# Altium project MCU103A.PrjPcb (part 2 of 4)

## Sheet MCU103A_F280039C_Device.SchDoc
size 431 x 279 mm; Date: Not shown in title block; ApprovedBy: Not shown in title block; CheckedBy: Not shown in title block; Author: Not shown in title block; CompanyName: Not shown in title block; Engineer: Not shown in title block; Organization: Not shown in title block; Address1: Not shown in title block; Address2: Not shown in title block; Address3: Not shown in title block; Address4: Not shown in title block; DocumentNumber: 4; Revision: Use project parameter SCH_Rev; SheetNumber: 4; SheetTotal: 8; PageSetup: Record=PageOptions|CenterHorizontal=True|CenterVertical=True|PrintScale=1.00|XCorrection=1.00|YCorrection=1.00|PrintKind=0|BorderSize=5000000|LeftOffset=0|BottomOffset=0|Orientation=2|PaperLength=1000|PaperWidth=1000|Scale=100|PaperSource=15|PrintQuality=600|MediaType=1|DitherType=10|PaperKind=Letter|PrintScaleMode=1; CurrentTime: Not shown in title block; CurrentDate: Not shown in title block; Time: Not shown in title block; DocumentFullPathAndName: Not shown in title block; DocumentName: Not shown in title block; ModifiedDate: Not shown in title block; ImagePath: Not shown in title block
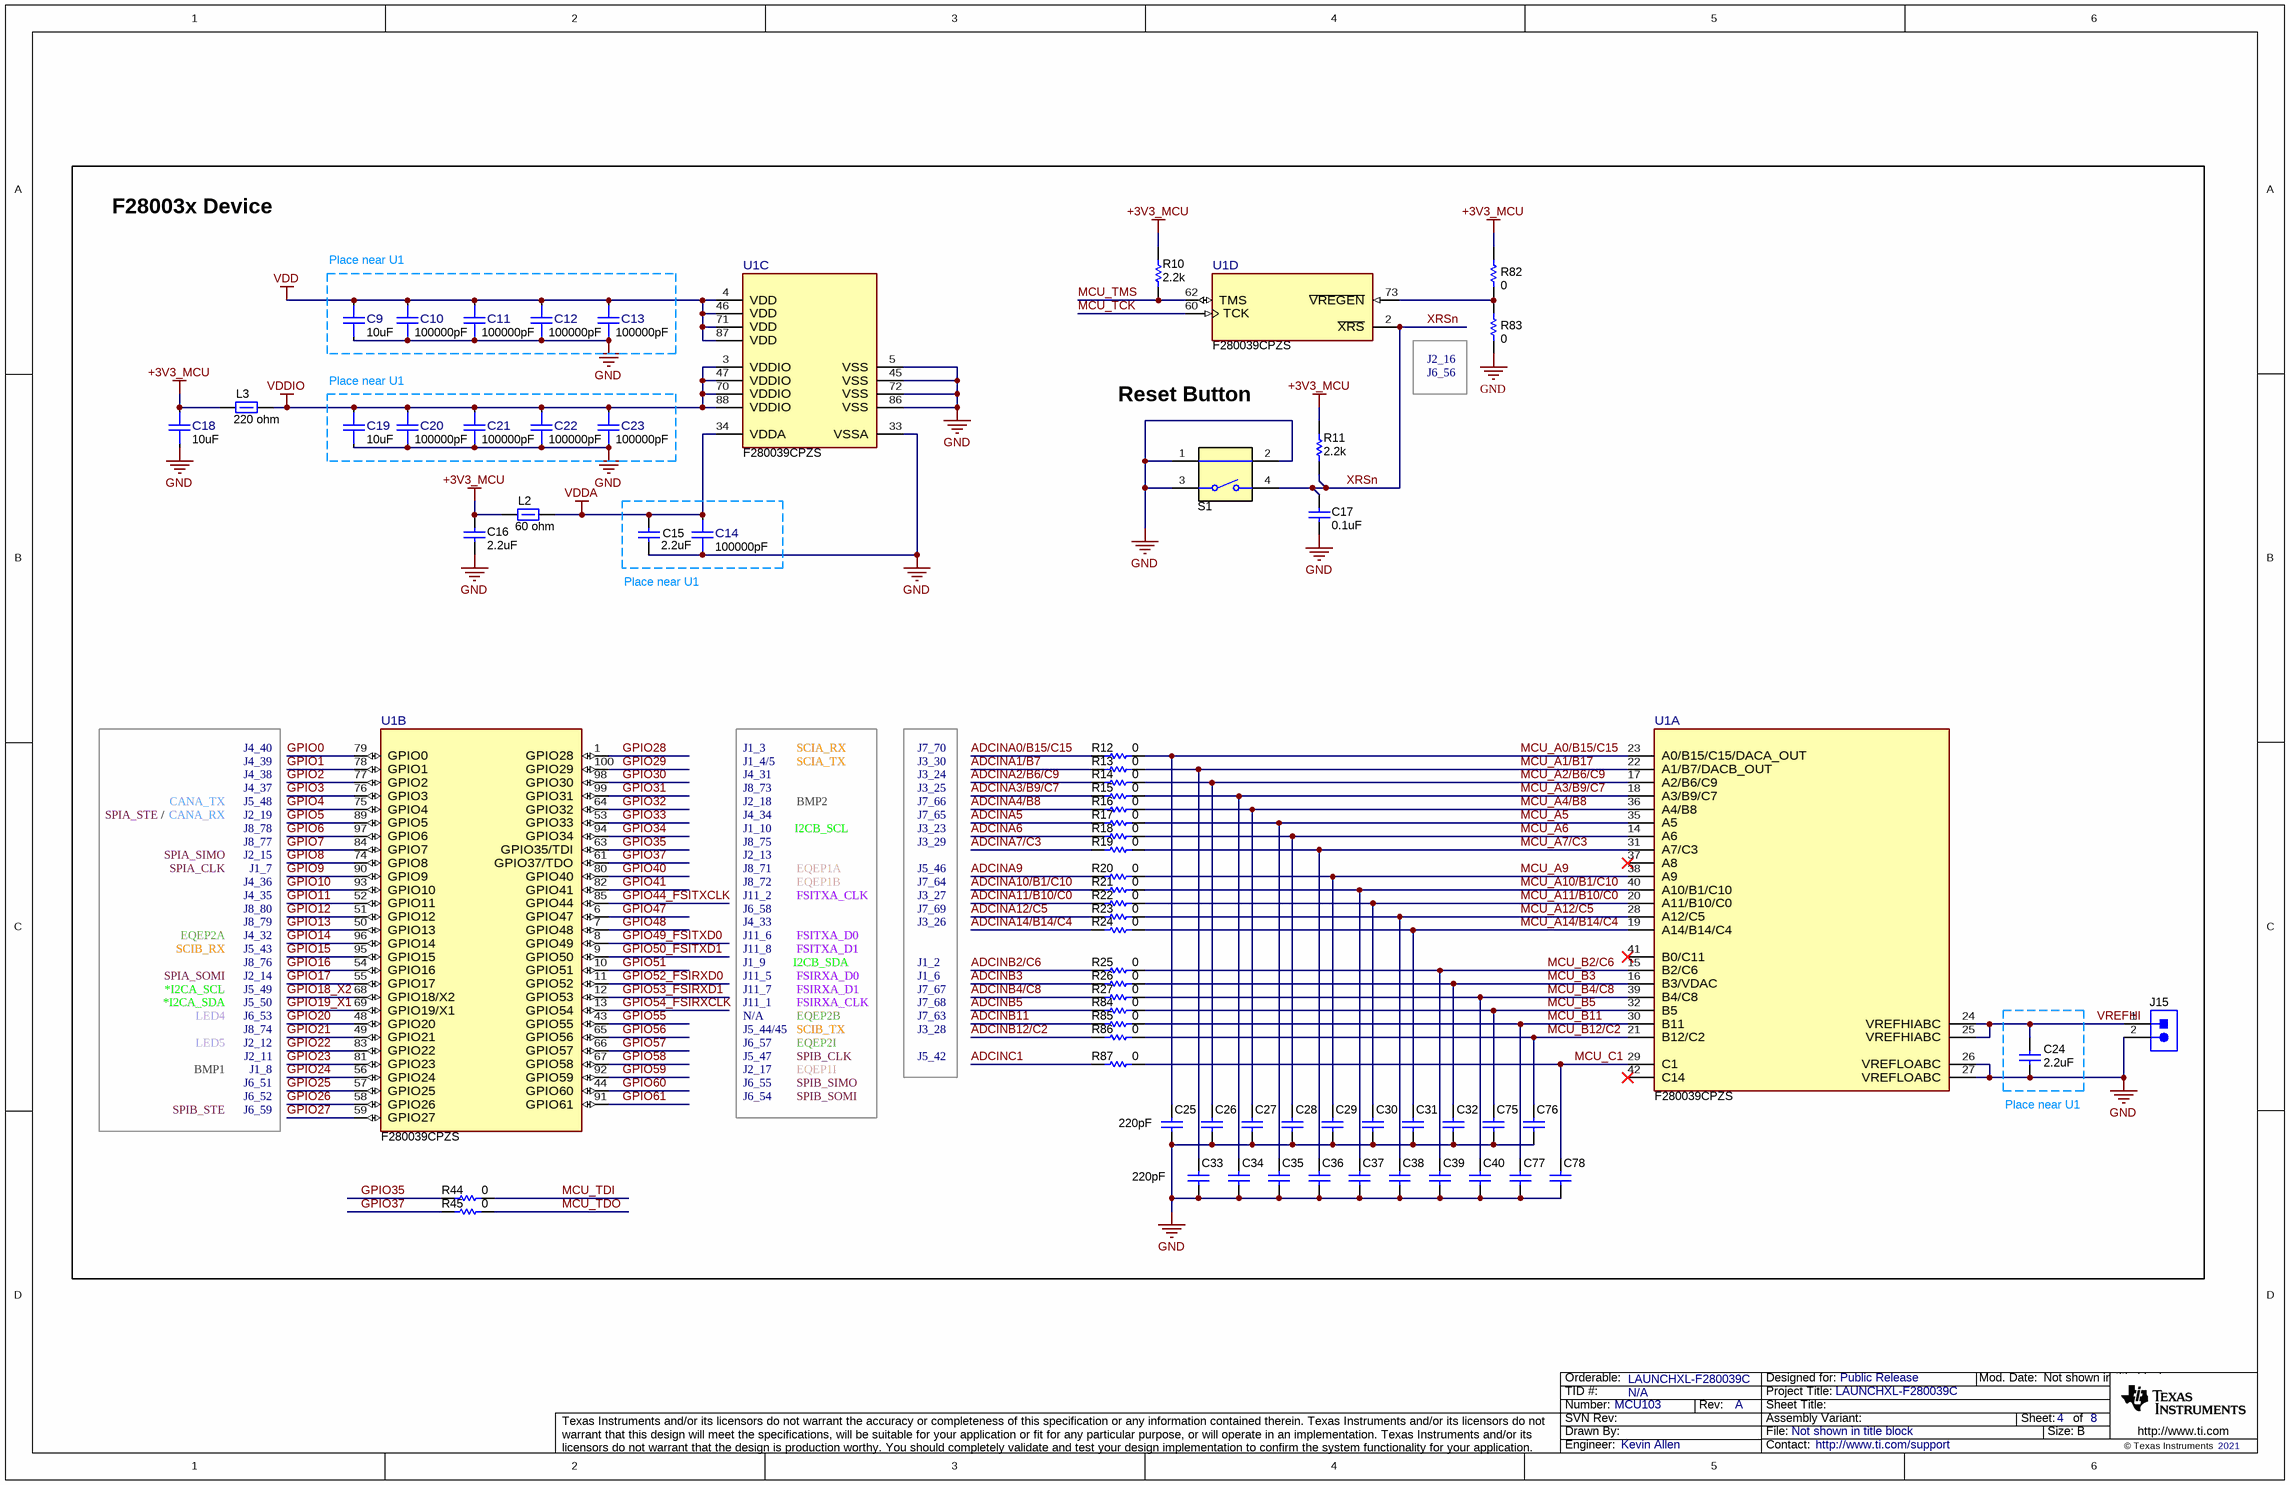
[diagram p3: MCU103A_F280039C_Device.SchDoc]

### Parts
C9  ValueDisplayed: 10uF  [FP-CC0603KRX5R6BB106_0603-MFG]  (hidden comment: CC0603KRX5R6BB106)
C10  ValueDisplayed: 100000pF  [FP-885012205018_0402-MFG]  (hidden comment: 885012205018)
C11  ValueDisplayed: 100000pF  [FP-885012205018_0402-MFG]  (hidden comment: 885012205018)
C12  ValueDisplayed: 100000pF  [FP-885012205018_0402-MFG]  (hidden comment: 885012205018)
C13  ValueDisplayed: 100000pF  [FP-885012205018_0402-MFG]  (hidden comment: 885012205018)
C14  ValueDisplayed: 100000pF  [FP-885012205018_0402-MFG]  (hidden comment: 885012205018)
C15  ValueDisplayed: 2.2uF  [0603]  (hidden comment: GRM188R61A225KE34D)
C16  ValueDisplayed: 2.2uF  [0603]  (hidden comment: GRM188R61A225KE34D)
C17  ValueDisplayed: 0.1uF  [0402]  (hidden comment: GRM155R71A104KA01D)
C18  ValueDisplayed: 10uF  [FP-CC0603KRX5R6BB106_0603-MFG]  (hidden comment: CC0603KRX5R6BB106)
C19  ValueDisplayed: 10uF  [FP-CC0603KRX5R6BB106_0603-MFG]  (hidden comment: CC0603KRX5R6BB106)
C20  ValueDisplayed: 100000pF  [FP-885012205018_0402-MFG]  (hidden comment: 885012205018)
C21  ValueDisplayed: 100000pF  [FP-885012205018_0402-MFG]  (hidden comment: 885012205018)
C22  ValueDisplayed: 100000pF  [FP-885012205018_0402-MFG]  (hidden comment: 885012205018)
C23  ValueDisplayed: 100000pF  [FP-885012205018_0402-MFG]  (hidden comment: 885012205018)
C24  ValueDisplayed: 2.2uF  [0603]  (hidden comment: GRM188R61A225KE34D)
C25  ValueDisplayed: 220pF  [0402]  (hidden comment: 885012005063)
C26  885012005063  [0402]  (value not drawn)
C27  885012005063  [0402]  (value not drawn)
C28  885012005063  [0402]  (value not drawn)
C29  885012005063  [0402]  (value not drawn)
C30  885012005063  [0402]  (value not drawn)
C31  885012005063  [0402]  (value not drawn)
C32  885012005063  [0402]  (value not drawn)
C33  ValueDisplayed: 220pF  [0402]  (hidden comment: 885012005063)
C34  885012005063  [0402]  (value not drawn)
C35  885012005063  [0402]  (value not drawn)
C36  885012005063  [0402]  (value not drawn)
C37  885012005063  [0402]  (value not drawn)
C38  885012005063  [0402]  (value not drawn)
C39  885012005063  [0402]  (value not drawn)
C40  885012005063  [0402]  (value not drawn)
C75  885012005063  [0402]  (value not drawn)
C76  885012005063  [0402]  (value not drawn)
C77  885012005063  [0402]  (value not drawn)
C78  885012005063  [0402]  (value not drawn)
J15  61300211121  [WURTH_61300211121]  (value not drawn)
L2  value 60 ohm  [0805_HV]  (hidden comment: 742792063)
L3  ValueDisplayed: 220 ohm  [0805_HV]  (hidden comment: 742792022)
R10  ValueDisplayed: 2.2k  [0402]  (hidden comment: CRCW04022K20JNED)
R11  ValueDisplayed: 2.2k  [0402]  (hidden comment: CRCW04022K20JNED)
R12  ValueDisplayed: 0  [0402]  (hidden comment: RC0402JR-070RL)
R13  ValueDisplayed: 0  [0402]  (hidden comment: RC0402JR-070RL)
R14  ValueDisplayed: 0  [0402]  (hidden comment: RC0402JR-070RL)
R15  ValueDisplayed: 0  [0402]  (hidden comment: RC0402JR-070RL)
R16  ValueDisplayed: 0  [0402]  (hidden comment: RC0402JR-070RL)
R17  ValueDisplayed: 0  [0402]  (hidden comment: RC0402JR-070RL)
R18  ValueDisplayed: 0  [0402]  (hidden comment: RC0402JR-070RL)
R19  ValueDisplayed: 0  [0402]  (hidden comment: RC0402JR-070RL)
R20  ValueDisplayed: 0  [0402]  (hidden comment: RC0402JR-070RL)
R21  ValueDisplayed: 0  [0402]  (hidden comment: RC0402JR-070RL)
R22  ValueDisplayed: 0  [0402]  (hidden comment: RC0402JR-070RL)
R23  ValueDisplayed: 0  [0402]  (hidden comment: RC0402JR-070RL)
R24  ValueDisplayed: 0  [0402]  (hidden comment: RC0402JR-070RL)
R25  ValueDisplayed: 0  [0402]  (hidden comment: RC0402JR-070RL)
R26  ValueDisplayed: 0  [0402]  (hidden comment: RC0402JR-070RL)
R27  ValueDisplayed: 0  [0402]  (hidden comment: RC0402JR-070RL)
R44  ValueDisplayed: 0  [0402]  (hidden comment: RC0402JR-070RL)
R45  ValueDisplayed: 0  [0402]  (hidden comment: RC0402JR-070RL)
R82  ValueDisplayed: 0  [0603]  (hidden comment: CRCW06030000Z0EA)
R83  ValueDisplayed: 0  [0603]  (hidden comment: CRCW06030000Z0EA)
R84  ValueDisplayed: 0  [0402]  (hidden comment: RC0402JR-070RL)
R85  ValueDisplayed: 0  [0402]  (hidden comment: RC0402JR-070RL)
R86  ValueDisplayed: 0  [0402]  (hidden comment: RC0402JR-070RL)
R87  ValueDisplayed: 0  [0402]  (hidden comment: RC0402JR-070RL)
S1  1188E-1K2-V-TR  [SW_1188E]  (value not drawn)
U1  F280039CPZS  [PZ0100A-MFG]  (parts A,B,C,D of 4)

### Nets
+3V3_MCU: C16.1 C18.2 L2.1 L3.1 R10.2 R11.2 R82.1
GND: C9.1 C10.1 C11.1 C12.1 C13.1 C14.1 C15.2 C16.2 C17.1 C18.1 C19.1 C20.1 C21.1 C22.1 C23.1 C24.2 C25.2 C26.2 C27.2 C28.2 C29.2 C30.2 C31.2 C32.2 C33.2 C34.2 C35.2 C36.2 C37.2 C38.2 C39.2 C40.2 C75.2 C76.2 C77.2 C78.2 J15.2 R83.2 S1.1 S1.2 S1.3 U1.5(VSS) U1.26(VREFLOABC) U1.27(VREFLOABC) U1.33(VSSA) U1.45(VSS) U1.72(VSS) U1.86(VSS)
VDD: C9.2 C10.2 C11.2 C12.2 C13.2 U1.4(VDD) U1.46(VDD) U1.71(VDD) U1.87(VDD)
VDDA: C14.2 C15.1 L2.2 U1.34(VDDA)
VDDIO: C19.2 C20.2 C21.2 C22.2 C23.2 L3.2 U1.3(VDDIO) U1.47(VDDIO) U1.70(VDDIO) U1.88(VDDIO)
ADCINA0/B15/C15: R12.1
ADCINA1/B7: R13.1
ADCINA2/B6/C9: R14.1
ADCINA3/B9/C7: R15.1
ADCINA4/B8: R16.1
ADCINA5: R17.1
ADCINA6: R18.1
ADCINA7/C3: R19.1
ADCINA9: R20.1
ADCINA10/B1/C10: R21.1
ADCINA11/B10/C0: R22.1
ADCINA12/C5: R23.1
ADCINA14/B14/C4: R24.1
ADCINB2/C6: R25.1
ADCINB3: R26.1
ADCINB4/C8: R27.1
ADCINB5: R84.1
ADCINB11: R85.1
ADCINB12/C2: R86.1
ADCINC1: R87.1
GPIO0: U1.79(GPIO0)
GPIO1: U1.78(GPIO1)
GPIO2: U1.77(GPIO2)
GPIO3: U1.76(GPIO3)
GPIO4: U1.75(GPIO4)
GPIO5: U1.89(GPIO5)
GPIO6: U1.97(GPIO6)
GPIO7: U1.84(GPIO7)
GPIO8: U1.74(GPIO8)
GPIO9: U1.90(GPIO9)
GPIO10: U1.93(GPIO10)
GPIO11: U1.52(GPIO11)
GPIO12: U1.51(GPIO12)
GPIO13: U1.50(GPIO13)
GPIO14: U1.96(GPIO14)
GPIO15: U1.95(GPIO15)
GPIO16: U1.54(GPIO16)
GPIO17: U1.55(GPIO17)
GPIO18_X2: U1.68(GPIO18/X2)
GPIO19_X1: U1.69(GPIO19/X1)
GPIO20: U1.48(GPIO20)
GPIO21: U1.49(GPIO21)
GPIO22: U1.83(GPIO22)
GPIO23: U1.81(GPIO23)
GPIO24: U1.56(GPIO24)
GPIO25: U1.57(GPIO25)
GPIO26: U1.58(GPIO26)
GPIO27: U1.59(GPIO27)
GPIO28: U1.1(GPIO28)
GPIO29: U1.100(GPIO29)
GPIO30: U1.98(GPIO30)
GPIO31: U1.99(GPIO31)
GPIO32: U1.64(GPIO32)
GPIO33: U1.53(GPIO33)
GPIO34: U1.94(GPIO34)
GPIO35: R44.1 U1.63(GPIO35/TDI)
GPIO37: R45.1 U1.61(GPIO37/TDO)
GPIO40: U1.80(GPIO40)
GPIO41: U1.82(GPIO41)
GPIO44_FSITXCLK: U1.85(GPIO44)
GPIO47: U1.6(GPIO47)
GPIO48: U1.7(GPIO48)
GPIO49_FSITXD0: U1.8(GPIO49)
GPIO50_FSITXD1: U1.9(GPIO50)
GPIO51: U1.10(GPIO51)
GPIO52_FSIRXD0: U1.11(GPIO52)
GPIO53_FSIRXD1: U1.12(GPIO53)
GPIO54_FSIRXCLK: U1.13(GPIO54)
GPIO55: U1.43(GPIO55)
GPIO56: U1.65(GPIO56)
GPIO57: U1.66(GPIO57)
GPIO58: U1.67(GPIO58)
GPIO59: U1.92(GPIO59)
GPIO60: U1.44(GPIO60)
GPIO61: U1.91(GPIO61)
MCU_A0/B15/C15: C25.1 R12.2 U1.23(A0/B15/C15/DACA_OUT)
MCU_A1/B17: C33.1 R13.2 U1.22(A1/B7/DACB_OUT)
MCU_A2/B6/C9: C26.1 R14.2 U1.17(A2/B6/C9)
MCU_A3/B9/C7: C34.1 R15.2 U1.18(A3/B9/C7)
MCU_A4/B8: C27.1 R16.2 U1.36(A4/B8)
MCU_A5: C35.1 R17.2 U1.35(A5)
MCU_A6: C28.1 R18.2 U1.14(A6)
MCU_A7/C3: C36.1 R19.2 U1.31(A7/C3)
MCU_A9: C29.1 R20.2 U1.38(A9)
MCU_A10/B1/C10: C37.1 R21.2 U1.40(A10/B1/C10)
MCU_A11/B10/C0: C30.1 R22.2 U1.20(A11/B10/C0)
MCU_A12/C5: C38.1 R23.2 U1.28(A12/C5)
MCU_A14/B14/C4: C31.1 R24.2 U1.19(A14/B14/C4)
MCU_B2/C6: C39.1 R25.2 U1.15(B2/C6)
MCU_B3: C32.1 R26.2 U1.16(B3/VDAC)
MCU_B4/C8: C40.1 R27.2 U1.39(B4/C8)
MCU_B5: C75.1 R84.2 U1.32(B5)
MCU_B11: C77.1 R85.2 U1.30(B11)
MCU_B12/C2: C76.1 R86.2 U1.21(B12/C2)
MCU_C1: C78.1 R87.2 U1.29(C1)
MCU_TCK: U1.60(TCK)
MCU_TDI: R44.2
MCU_TDO: R45.2
MCU_TMS: R10.1 U1.62(TMS)
VREFHI: C24.1 J15.1 U1.24(VREFHIABC) U1.25(VREFHIABC)
XRSn: C17.2 R11.1 S1.4 U1.2(~{XRS})
NetR82_2: R82.2 R83.1 U1.73(~{VREGEN})

Not connected (* = marked no-connect by the designer): U1 37(A8)* 41(B0/C11)* 42(C14)*

### Notes on the sheet
- F28003x Device
- Place near U1
- J2_16
- Reset Button
- J6_56
- J4_40
- J4_39
- J1_3
- J1_4/5
- SCIA_RX
- SCIA_TX
- J3_30
- J7_70
- SPIA_STE
- /
- CANA_TX
- CANA_RX
- J4_38
- J4_37
- J2_19
- J5_48
- J8_78
- J4_31
- J4_34
- J2_18
- J1_10
- J8_73
- BMP2
- I2CB_SCL
- J3_25
- J3_24
- J3_23
- J7_66
- J7_65
- SPIA_SIMO
- SPIA_CLK
- J4_36
- J4_35
- J2_15
- J1_7
- J8_77
- J2_13
- J8_75
- J8_72
- J8_71
- J11_2
- EQEP1A
- EQEP1B
- FSITXA_CLK
- J3_29
- J3_27
- J5_46
- J7_64
- EQEP2A
- SCIB_RX
- J4_32
- J5_43
- J8_80
- J8_79
- J8_76
- J4_33
- J1_9
- J6_58
- J11_6
- J11_8
- FSITXA_D0
- FSITXA_D1
- I2CB_SDA
- J1_2
- J3_26
- J7_69
- *I2CA_SCL
- *I2CA_SDA
- LED4
- SPIA_SOMI
- J2_14
- J5_49
- J5_50
- J8_74
- J6_53
- J5_44/45
- J11_5
- J11_7
- J11_1
- N/A
- FSIRXA_D0
- FSIRXA_D1
- FSIRXA_CLK
- EQEP2B
- SCIB_TX
- J1_6
- J3_28
- J7_68
- J7_67
- J7_63
- LED5
- BMP1
- J2_12
- J2_11
- J1_8
- J6_52
- J6_51
- J2_17
- J5_47
- J6_57
- J6_55
- J6_54
- EQEP2I
- EQEP1I
- SPIB_CLK
- SPIB_SIMO
- SPIB_SOMI
- J5_42
- (near C24) Place near U1
- SPIB_STE
- J6_59
- Drawn By:
- SVN Rev:
- Number:
- TID #:
- Orderable:
- Rev:
- Sheet Title:
- File:
- Project Title:
- Designed for:
- Assembly Variant:
- Mod. Date:
- Sheet:
- Size:
- of
- B
- http://www.ti.com
- Texas Instruments and/or its licensors do not warrant the accuracy or completeness of this specification or any information contained therein. Texas Instruments and/or its licensors do not warrant that this design will meet the specifications, will be suitable for your application or fit for any particular purpose, or will operate in an implementation. Texas Instruments and/or its licensors do not warrant that the design is production worthy. You should completely validate and test your design implementation to confirm the system functionality for your application.
- Engineer:
- Contact:
- © Texas Instruments

### Library data of the parts
C9 C18 C19 = CMP-0092309-1: Cap Ceramic 10uF 10V X5R 10% SMD 0603 85C Paper T/R; Manufacturer: YAGEO; Cap_F: 10µF; TempCo: 15%; Category 7542B8484461Ae85: Passive Components; Category 4C11811B7D3097D6: Single Components; SizeZ_mm: 1mm; Category F8883582C9A8234F: Capacitors; AEC Qualified: No; Value: 10µF; Category 85Ce48C4B2B95E09: Uncategorized; Supplier Part Number 2: 603-CC603KRX5R6BB106; Operating Temperature Range: -55°C to +85°C; PackageReference: 0603; Supplier Part Number 1: 311-1782-1-ND; Digikey Part Number: 311-1782-1-ND; Digikey Description: CAP CER 10UF 10V X5R 0603; Tolerance_%: 10%; datasheet: https://www.yageo.com/upload/media/product/productsearch/datasheet/mlcc/UPY-GPHC_X5R_4V-to-50V_26.pdf; ComponentLink1URL: https://www.yageo.com/upload/media/product/productsearch/datasheet/mlcc/UPY-GPHC_X5R_4V-to-50V_26.pdf; Supplier 2: Mouser; Octopart Part Number: 1f0ad7d7c223c0cd; VDC_V: 10V; Datasheet Path: datasheets/Cap-CC0603KRX5R6BB106.pdf; PartNumber: CC0603KRX5R6BB106; RoHS: TRUE; Part Number: CC0603KRX5R6BB106; helpURL: https://upverter.com/upn/revision/d12d152cf6e6e3e0/; ComponentLink1Description: Datasheet; Temperature Characteristic: X5R; Supplier 1: Digikey; Mouser Description: Multilayer Ceramic Capacitors MLCC - SMD/SMT 10M pF 10% 10 Volts; Mouser Part Number: 603-CC603KRX5R6BB106; Lead Free: Yes
C10-C14 C20-C23 = CMP-0090362-1: 0.1µF ±10% 10V Ceramic Capacitor X7R 0402 (1005 Metric); Manufacturer: Wurth Electronics; AEC Qualified: No; Value: 100nF; SizeZ_mm: 0.55mm; TempCo: 15%; RoHS: TRUE; Tolerance_%: 10%; datasheet: https://www.we-online.com/catalog/datasheet/885012205018.pdf; Lead Free: Yes; Operating Temperature Range: -55°C to +125°C; ComponentLink1Description: Datasheet; Digikey Description: CAP CER 0.1UF 10V X7R 0402; Supplier Part Number 1: 732-7513-1-ND; Supplier 2: Mouser; Mouser Part Number: 710-885012205018; Digikey Part Number: 732-7513-1-ND; Temperature Characteristic: X7R; Supplier 1: Digikey; Datasheet Path: datasheets/Cap-885012205018.pdf; ComponentLink1URL: https://www.we-online.com/catalog/datasheet/885012205018.pdf; VDC_V: 10V; Supplier Part Number 2: 710-885012205018; Cap_F: 100nF; PackageReference: 0402; PartNumber: 885012205018; Part Number: 885012205018; helpURL: https://upverter.com/upn/revision/1acbe355db19639d/
C15 C16 C24 = CMP-0007323-5: CAP, CERM, 2.2 uF, 10 V, +/- 10%, X5R, 0603; Manufacturer: MuRata; Polarized: N; Value: 2.2uF; U/M: EA; Cap_F: 2.2µF; Value1: Unknown; VDC_V: 10V; TaMin_C: -55°C; TaMax_C: 85°C; SizeArea_mm2: 1.28; SizeAreaWB_mm2: 4.68; SizeX_mm: 1.6; SizeY_mm: 0.8; SizeZ_mm: 1; AEC Category: Q200; CompType: Capacitor; PartNumber: GRM188R61A225KE34D; PackageReference: 0603; RoHS: Y; Tolerance_%: 10%; Value2: 10V; MountType: SMT; Technology: Ceramic; TempCo: X5R; Cap_Case: 0603; Published: 2008-06-19; Publisher: Texas Instruments; LatestRevisionDate: 2017-03-09; ComponentLink1Description: Datasheet link; ComponentLink1URL: http://search.murata.co.jp/Ceramy/PnsearchViewAction.do?HnOFG=ON&HnNFG=ON&SEL_CNT=50&sLang=en&sKey=GRM188R61A225KE34D&x=9&y=9&search=startwith; Supplier 1: Digi-Key; Supplier Part Number 1: 490-1545-1-ND; Supplier 2: Mouser; Supplier Part Number 2: 81-GRM188R61A225KE34; Supplier 3: Farnell; Supplier Part Number 3: 1828799; AEC Qualified: ?
C17 = CMP-0006629-2: CAP, CERM, 0.1 uF, 10 V, +/- 10%, X7R, 0402; Manufacturer: MuRata; Polarized: N; Value: 0.1uF; U/M: EA; Cap_F: 100nF; Value1: Unknown; VDC_V: 10V; TaMin_C: -55°C; TaMax_C: 125°C; SizeArea_mm2: 0.5; SizeAreaWB_mm2: 3; SizeX_mm: 1; SizeZ_mm: 0.6; AEC Category: Q200; CompType: Capacitor; PartNumber: GRM155R71A104KA01D; PackageReference: 0402; RoHS: Y; Tolerance_%: 10%; Value2: 10V; MountType: SMT; Technology: Ceramic; TempCo: X7R; Cap_Case: 0402; SizeY_mm: 0.5; Published: 2008-06-19; Publisher: Texas Instruments; LatestRevisionDate: 2017-03-09; ComponentLink1Description: Datasheet link; ComponentLink1URL: http://search.murata.co.jp/Ceramy/PnsearchViewAction.do?HnOFG=ON&HnNFG=ON&SEL_CNT=50&sLang=en&sKey=GRM155R71A104KA01D&x=9&y=9&search=startwith; Supplier 1: Digi-Key; Supplier Part Number 1: GRM155R71A104KA01D-ND; Supplier 2: Newark; Supplier Part Number 2: 14T3278; Supplier 3: Mouser; Supplier Part Number 3: 81-GRM155R71A104KA1D; AEC Qualified: ?
C25-C40 C75-C78 = CMP-0006218-2: CAP, CERM, 220 pF, 50 V, +/- 5%, C0G/NP0, 0402; Manufacturer: Wurth Elektronik; TaMin_C: -55°C; Polarized: N; SizeAreaWB_mm2: 3; Value1: Unknown; U/M: EA; Value: 220pF; TaMax_C: 125°C; SizeZ_mm: 0.6; SizeX_mm: 1; SizeY_mm: 0.5; Value2: 50V; AEC Category: Q200; Supplier Part Number 2: 710-885012005063; Publisher: Texas Instruments; Supplier 2: Mouser; TempCo: C0G/NP0; Published: 2008-06-19; RoHS: Y; MountType: SMT; Supplier 1: Digi-Key; PackageReference: 0402; Tolerance_%: 5%; Cap_Case: 0402; SizeArea_mm2: 0.5; CompType: Capacitor; LatestRevisionDate: 2017-03-09; PartNumber: 885012005063; AEC Qualified: N; Cap_F: 220pF; VDC_V: 50V; ComponentLink1Description: Datasheet link; AEC Grade: N/A; Supplier Part Number 1: 732-7477-1-ND; Technology: Ceramic; ComponentLink1URL: http://katalog.we-online.de/pbs/datasheet/885012005063.pdf
  C26-C32 C34-C40 C75-C78: ValueDisplayed: 220pF
J15 = CMP-0054794-1: Header, 2.54 mm, 2x1, Gold, TH; Manufacturer: Wurth Elektronik; Green_Lifecycle: Active; Green_REACh: Passed; CNHeader: TRUE; CT: FALSE; PartNumber: 61300211121; PackageReference: Header, 2.54mm, 2x1, TH; ClassName: Header; CompType: Header; RoHS: Y; MountType: TH; ComponentLink1Description: Datasheet URL; ComponentLink1URL: http://katalog.we-online.de/em/datasheet/6130xx11121.pdf; Publisher: Texas Instruments; LatestRevisionDate: 26/05/2017; Supplier 1: Digi-Key; Supplier Part Number 1: 732-5315-ND; Supplier 2: Newark; Supplier Part Number 2: 20X0948; Supplier 3: Mouser; Supplier Part Number 3: 710-61300211121; Green_EU RoHS: Passed; Green_EU RoHS-2: Incomplete
L2 = CMP-0003093-1: Ferrite Bead, 60 ohm @ 100 MHz, 3 A, 0805; Manufacturer: Wurth Elektronik; Ztyp@1GHz_Ohm: 95.384; ZTyp@100MHz_Ohm: 60; SizeAreaWB_mm2: 6.75; DCR_ohm: 0.025; Value1: 0.025 ohm; Imax_A: 3A; SizeZ_mm: 1.45; SizeX_mm: 2; SizeY_mm: 1.25; SizeArea_mm2: 2.5; ComponentLink1URL: http://katalog.we-online.de/pbs/datasheet/742792063.pdf; Supplier Part Number 2: 710-742792063; Publisher: Texas Instruments; Supplier 2: Mouser; Published: 2014-04-30; RoHS: Y; MountType: SMT; Supplier 1: Digi-Key; PackageReference: 0805; Value2: 3A; CompType: Ferrite Bead; LatestRevisionDate: 2017-03-09; PartNumber: 742792063; ComponentLink1Description: Datasheet link; Supplier Part Number 1: 732-1612-1-ND; ValueDisplayed: 60 ohm
L3 = CMP-0003073-1: Ferrite Bead, 220 ohm @ 100 MHz, 2 A, 0805; Manufacturer: Wurth Elektronik; Ztyp@1GHz_Ohm: 190.289; ZTyp@100MHz_Ohm: 220; SizeAreaWB_mm2: 6.75; DCR_ohm: 0.05; Value1: 0.05 ohm; Value: 220 ohm; Imax_A: 2A; SizeZ_mm: 1.45; SizeX_mm: 2; SizeY_mm: 1.25; SizeArea_mm2: 2.5; ComponentLink1URL: http://katalog.we-online.de/pbs/datasheet/742792022.pdf; Supplier Part Number 2: 710-742792022; Publisher: Texas Instruments; Supplier 2: Mouser; Published: 2014-04-30; RoHS: Y; MountType: SMT; Supplier 1: Digi-Key; PackageReference: 0805; Value2: 2A; CompType: Ferrite Bead; LatestRevisionDate: 2017-03-09; PartNumber: 742792022; ComponentLink1Description: Datasheet link; Supplier Part Number 1: 732-1614-1-ND
R10 R11 = CMP-0026890-5: RES, 2.2 k, 5%, 0.063 W, AEC-Q200 Grade 0, 0402; Manufacturer: Vishay-Dale; Value: 2.2k; Value_Code: 2k20; Power_W: 63mW; Value2: 0.063W; VDC_V: 50V; TempCo: 200 ppm/C; SizeArea_mm2: 0.5; SizeX_mm: 1; SizeZ_mm: 0.6; EIA_Code: E24; AEC Category: Q200; AEC Qualified: Y; AEC Grade: 0; CompType: Resistor; PartNumber: CRCW04022K20JNED; PackageReference: 0402; RoHS: E; Res_ohm: 2.2k; Tolerance_%: 5%; Value1: 5%; MountType: SMT; Technology: Thick Film; SizeY_mm: 0.5; ComponentLink1Description: Datasheet link; ComponentLink1URL: http://www.vishay.com/docs/20035/dcrcwe3.pdf; Supplier 1: Digi-Key; Supplier Part Number 1: 541-2.2KJCT-ND; Supplier 2: Newark; Supplier Part Number 2: 59M6710; Supplier 3: Mouser; Supplier Part Number 3: 71-CRCW0402J-2.2K-E3
R12-R27 R44 R45 R84-R87 = CMP-0027004-2: RES, 0, 5%, 0.063 W, 0402; Manufacturer: Yageo America; Power_W: 63mW; TempCo: 200 ppm/C; Value_Code: 0000; U/M: EA; Value: 0; EIA_Code: E24; SizeX_mm: 1; SizeY_mm: 0.5; SizeZ_mm: 0.6; Value2: 0.063W; VDC_V: 50V; AEC Category: Q200; Supplier Part Number 2: 603-RC0402JR-070RL; Publisher: Texas Instruments; Supplier 2: Mouser; Supplier Part Number 3: 9232516; Supplier 3: Farnell; Published: 2008-06-26; RoHS: Y; Value1: 5%; MountType: SMT; Supplier 1: Digi-Key; PackageReference: 0402; Tolerance_%: 5%; Res_ohm: 0; SizeArea_mm2: 0.5; CompType: Resistor; LatestRevisionDate: 2017-03-09; PartNumber: RC0402JR-070RL; AEC Qualified: ?; ComponentLink1Description: Datasheet link; Supplier Part Number 1: 311-0.0JRCT-ND; Technology: Thick Film; ComponentLink1URL: http://www.yageo.com/pdf/Pu-RC0402_51_PbFree_L_2.pdf
R82 R83 = CMP-0025697-4: RES, 0, 5%, 0.1 W, AEC-Q200 Grade 0, 0603; Manufacturer: Vishay-Dale; Value: 0; Value_Code: 0000; Power_W: 100mW; Value2: 0.1W; VDC_V: 75V; TempCo: 200 ppm/C; SizeArea_mm2: 1.28; SizeX_mm: 1.6; SizeY_mm: 0.8; SizeZ_mm: 1; EIA_Code: E24; AEC Category: Q200; AEC Qualified: Y; CompType: Resistor; PartNumber: CRCW06030000Z0EA; PackageReference: 0603; RoHS: E; Res_ohm: 0; Tolerance_%: 5%; Value1: 5%; MountType: SMT; Technology: Thick Film; ComponentLink1Description: Datasheet link; ComponentLink1URL: http://www.vishay.com/docs/20035/dcrcwe3.pdf; Supplier 1: Digi-Key; Supplier Part Number 1: 541-0.0GCT-ND; Supplier 2: Newark; Supplier Part Number 2: 52K8014; Supplier 3: Mouser; Supplier Part Number 3: 71-CRCW0603-0-E3; AEC Grade: 0
S1 = CMP-0002328-1: Switch, SPST, 0.05 A, 12 VDC, SMD; Manufacturer: Diptronics; SizeAreaWB_mm2: 53.9; SizeArea_mm2: 27.3; SizeX_mm: 7.8; SizeY_mm: 3.5; VDC_V: 12V; PositionCount: 1; CurrentRating_mA: 50A; PartNumber: 1188E-1K2-V-TR; MountType: SMT; SizeZ_mm: 3.5; ComponentLink1Description: Datasheet URL; ComponentLink1URL: http://www.dip.com.tw/en/en-product-information/en-switch004/item/download/1976_b080c057386714e3a6604cbe658b9df3; RoHS: Y; Circuit: SPST; Orientation: Side Actuated; CompType: Switch; PackageReference: 7.8x3.5mm; Publisher: Texas Instruments; LatestRevisionDate: 2017-03-09
U1 = CMP-0091701-2: Real-Time Microcontroller 32bit, 120MHz, 384KBytes Flash, 69KBytes RAM, PQFP100; Manufacturer: Texas Instruments; Number Of Cores: 1; Core Architecture: TMS320C28x; SizeZ_mm: 1.6mm; Number Of A/D Converters: 3; AEC Qualified: No; Standoff Height: 0.05mm; TJmax_C: +125°C; Number Of Pwm Channels: 16; CompType: IC; Number Of I/Os: 55; Number Of Adc Channels: 23; Interface: I2C,SPI,UART,CAN,LIN,SCI,Other; Data Bus Width: 32bits; Number Of Spi Channels: 2; Number Of Uart Channels: 4; AEC Category: Q200; Memory Size: 384KBytes; ComponentLink3Description: Online Datasheet; Memory Type: FLASH; PackageReference: PQFP100; Operating Temperature Range: -40°C to +125°C; Frequency_Fixed: 120MHz; Part Number: F280039CPZS; ComponentLink1URL: http://www.ti.com/lit/ds/symlink/GPN.pdf; ComponentLink3URL: http://www.ti.com/product/GPN/datasheet; ComponentLink2Description: Product Folder; PartNumber: F280039CPZS; Ram Size: 69KBytes; ComponentLink1Description: Datasheet Link; RoHS: UNKNOWN; Number Of Timers/Counters: 3; helpURL: https://upverter.com/upn/revision/79ab1500d65182d7/; ComponentLink2URL: http://www.ti.com/product/GPN; Number Of I2C Channels: 2; Datasheet Path: datasheets/IC-F280039CPZS.pdf

## Sheet MCU103A_F2800137_Device.SchDoc
size 431 x 279 mm; Date: Not shown in title block; ApprovedBy: Not shown in title block; CheckedBy: Not shown in title block; Author: Not shown in title block; CompanyName: Not shown in title block; Engineer: Not shown in title block; Organization: Not shown in title block; Address1: Not shown in title block; Address2: Not shown in title block; Address3: Not shown in title block; Address4: Not shown in title block; DocumentNumber: 4; Revision: Use project parameter SCH_Rev; SheetNumber: 5; SheetTotal: 8; PageSetup: Record=PageOptions|CenterHorizontal=True|CenterVertical=True|PrintScale=1.00|XCorrection=1.00|YCorrection=1.00|PrintKind=0|BorderSize=5000000|LeftOffset=0|BottomOffset=0|Orientation=2|PaperLength=1000|PaperWidth=1000|Scale=100|PaperSource=15|PrintQuality=600|MediaType=1|DitherType=10|PaperKind=Letter|PrintScaleMode=1; CurrentTime: Not shown in title block; CurrentDate: Not shown in title block; Time: Not shown in title block; DocumentFullPathAndName: Not shown in title block; DocumentName: Not shown in title block; ModifiedDate: Not shown in title block; ImagePath: Not shown in title block
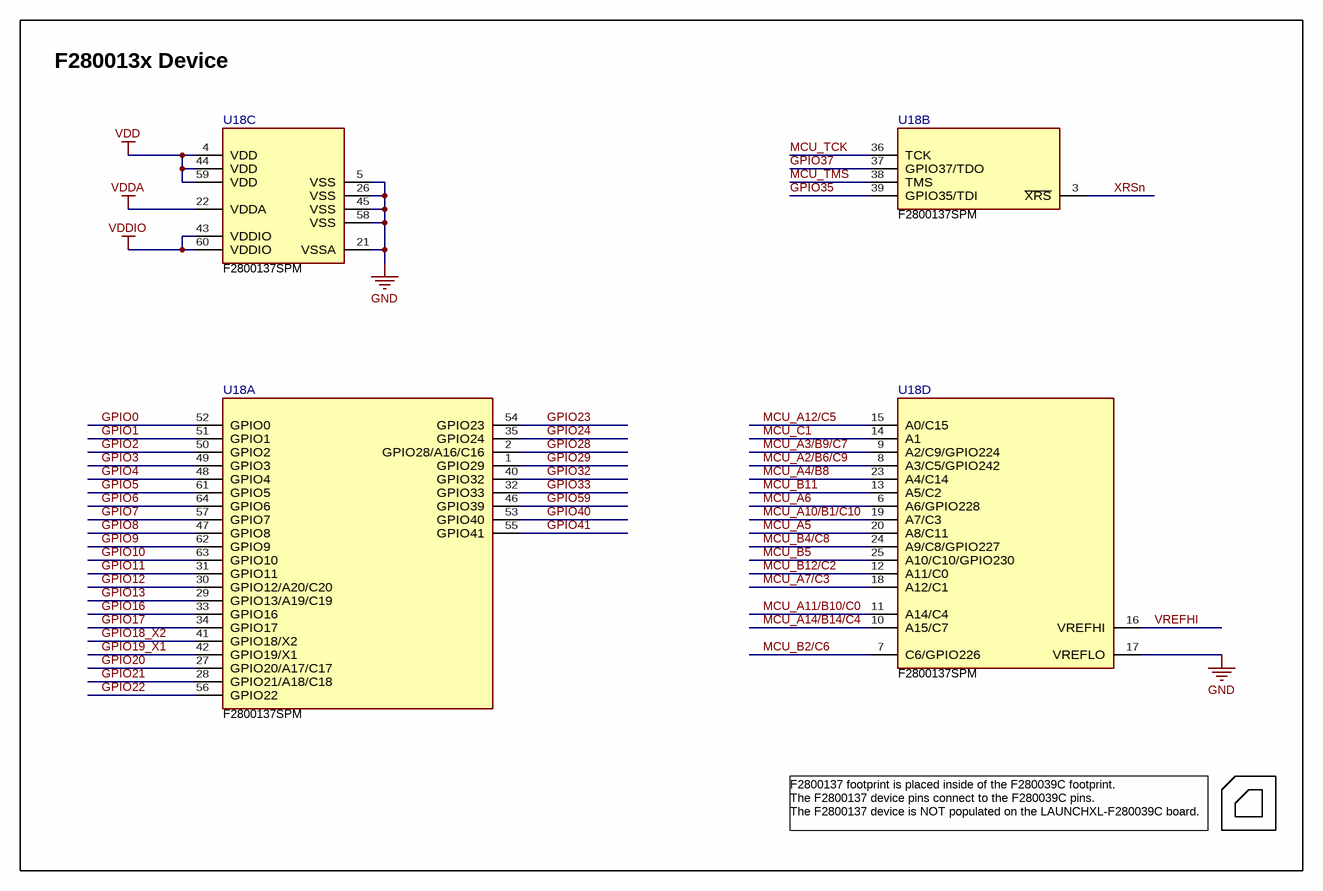
[diagram p4: MCU103A_F2800137_Device.SchDoc]

### Parts
U18  F2800137SPM  [PM0064A-IPC_C]  (parts A,B,C,D of 4)

### Blocks framed on the sheet
F280013x Device: U18

### Nets
GND: U18.5(VSS) U18.17(VREFLO) U18.21(VSSA) U18.26(VSS) U18.45(VSS) U18.58(VSS)
VDD: U18.4(VDD) U18.44(VDD) U18.59(VDD)
VDDA: U18.22(VDDA)
VDDIO: U18.43(VDDIO) U18.60(VDDIO)
GPIO0: U18.52(GPIO0)
GPIO1: U18.51(GPIO1)
GPIO2: U18.50(GPIO2)
GPIO3: U18.49(GPIO3)
GPIO4: U18.48(GPIO4)
GPIO5: U18.61(GPIO5)
GPIO6: U18.64(GPIO6)
GPIO7: U18.57(GPIO7)
GPIO8: U18.47(GPIO8)
GPIO9: U18.62(GPIO9)
GPIO10: U18.63(GPIO10)
GPIO11: U18.31(GPIO11)
GPIO12: U18.30(GPIO12/A20/C20)
GPIO13: U18.29(GPIO13/A19/C19)
GPIO16: U18.33(GPIO16)
GPIO17: U18.34(GPIO17)
GPIO18_X2: U18.41(GPIO18/X2)
GPIO19_X1: U18.42(GPIO19/X1)
GPIO20: U18.27(GPIO20/A17/C17)
GPIO21: U18.28(GPIO21/A18/C18)
GPIO22: U18.56(GPIO22)
GPIO23: U18.54(GPIO23)
GPIO24: U18.35(GPIO24)
GPIO28: U18.2(GPIO28/A16/C16)
GPIO29: U18.1(GPIO29)
GPIO32: U18.40(GPIO32)
GPIO33: U18.32(GPIO33)
GPIO35: U18.39(GPIO35/TDI)
GPIO37: U18.37(GPIO37/TDO)
GPIO40: U18.53(GPIO40)
GPIO41: U18.55(GPIO41)
GPIO59: U18.46(GPIO39)
MCU_A2/B6/C9: U18.8(A3/C5/GPIO242)
MCU_A3/B9/C7: U18.9(A2/C9/GPIO224)
MCU_A4/B8: U18.23(A4/C14)
MCU_A5: U18.20(A8/C11)
MCU_A6: U18.6(A6/GPIO228)
MCU_A7/C3: U18.18(A12/C1)
MCU_A10/B1/C10: U18.19(A7/C3)
MCU_A11/B10/C0: U18.11(A14/C4)
MCU_A12/C5: U18.15(A0/C15)
MCU_A14/B14/C4: U18.10(A15/C7)
MCU_B2/C6: U18.7(C6/GPIO226)
MCU_B4/C8: U18.24(A9/C8/GPIO227)
MCU_B5: U18.25(A10/C10/GPIO230)
MCU_B11: U18.13(A5/C2)
MCU_B12/C2: U18.12(A11/C0)
MCU_C1: U18.14(A1)
MCU_TCK: U18.36(TCK)
MCU_TMS: U18.38(TMS)
VREFHI: U18.16(VREFHI)
XRSn: U18.3(~{XRS})

### Notes on the sheet
- F2800137 footprint is placed inside of the F280039C footprint.
  The F2800137 device pins connect to the F280039C pins.
  The F2800137 device is NOT populated on the LAUNCHXL-F280039C board.
- Drawn By:
- SVN Rev:
- Number:
- TID #:
- Orderable:
- Rev:
- Sheet Title:
- File:
- Project Title:
- Designed for:
- Assembly Variant:
- Mod. Date:
- Sheet:
- Size:
- of
- B
- http://www.ti.com
- Texas Instruments and/or its licensors do not warrant the accuracy or completeness of this specification or any information contained therein. Texas Instruments and/or its licensors do not warrant that this design will meet the specifications, will be suitable for your application or fit for any particular purpose, or will operate in an implementation. Texas Instruments and/or its licensors do not warrant that the design is production worthy. You should completely validate and test your design implementation to confirm the system functionality for your application.
- Engineer:
- Contact:
- © Texas Instruments

### Library data of the parts
U18 = CMP-0092020-1: Manufacturer: Texas Instruments; Standoff Height: 0.05mm; SizeZ_mm: 1.6mm; Part Number: F2800137SPM; Datasheet Path: datasheets/-F2800137SPM.pdf; PartNumber: F2800137SPM; PackageReference: LQFP64; helpURL: https://upverter.com/upn/revision/9bbda0e19f6e20ca/; RoHS: UNKNOWN; Operating Temperature Range: to; PartId: 1